# Altium schematic sheet SIM808 dev Board V1.0.2.SchDoc: SIM808 Development Board
size A4; Engineer: Ali Rohanizadeh; DocumentNumber: 1; Revision: 1; SheetNumber: 1; SheetTotal: 1
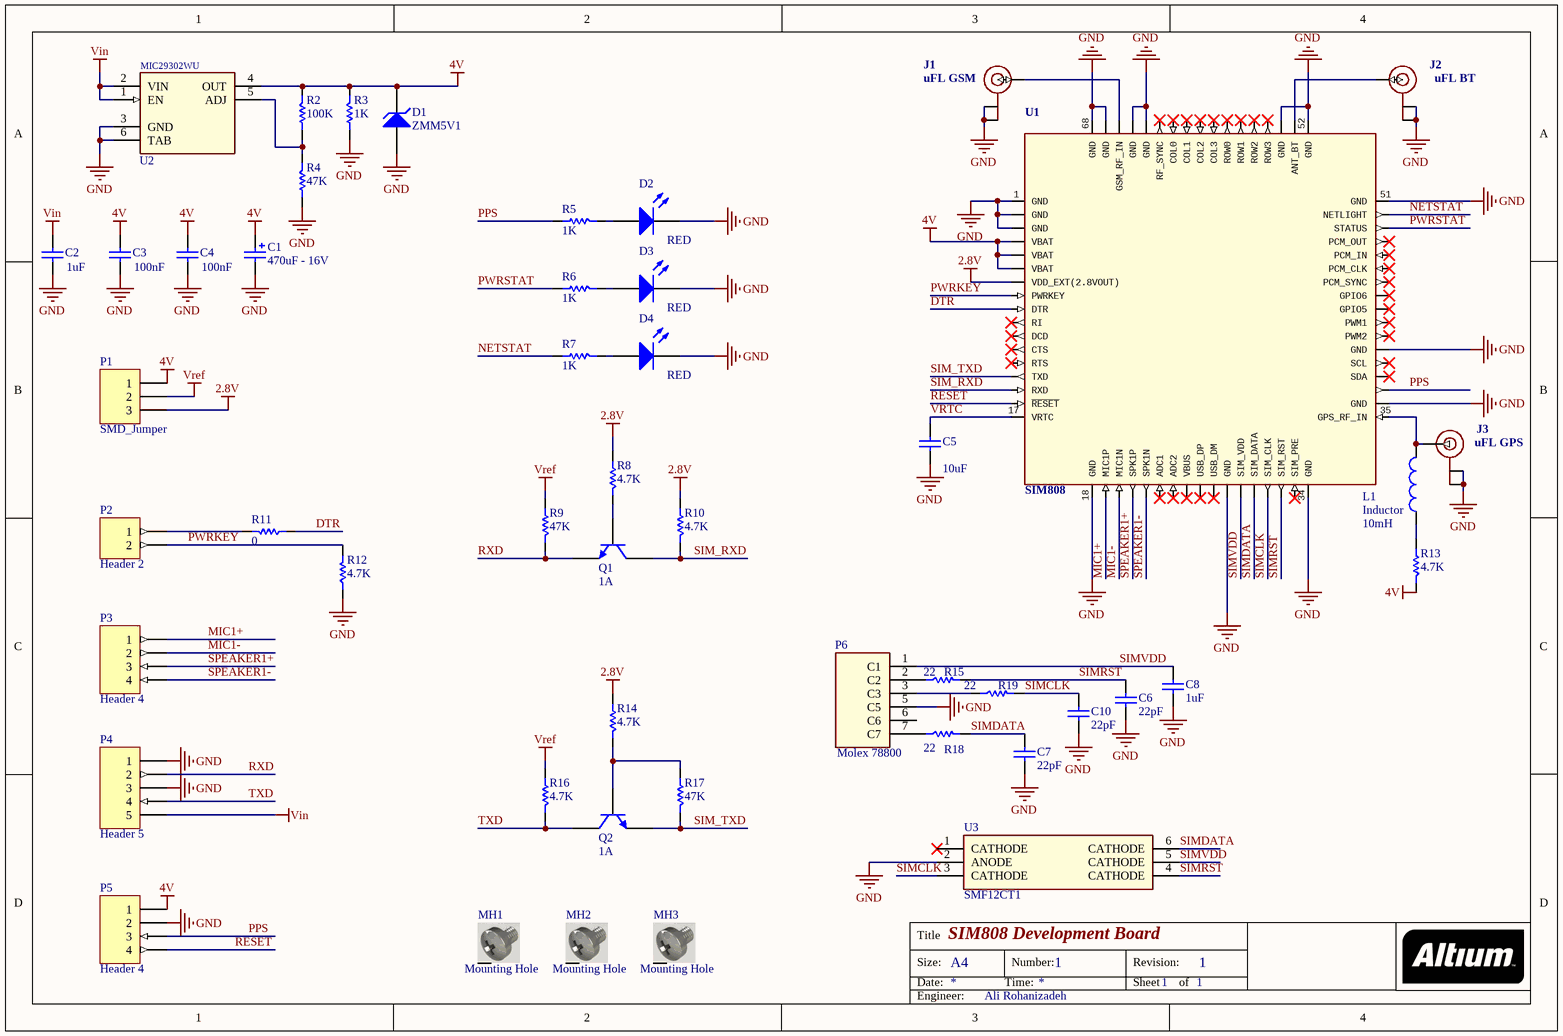
[diagram p0: SIM808 dev Board V1.0.2.SchDoc]

## Parts
C1  value 470uF - 16V  [CAP-D]  (hidden comment: 470uF)
C2  1uF  [CAP0603]
C3  100nF  [CAP0603]
C4  100nF  [CAP0603]
C5  10uF  [CAP1206]
C6  22pF  [CAP0603]
C7  22pF  [CAP0603]
C8  1uF  [CAP0603]
C10  22pF  [CAP0603]
D1  ZMM5V1  [ZMM5V1]
D2  Color: RED  [LED0603R]  (hidden comment: PPS)
D3  Color: RED  [LED0603R]  (hidden comment: STA)
D4  Color: RED  [LED0603R]  (hidden comment: NET)
J1  uFL GSM  [UFL]
J2  uFL BT  [UFL]
J3  uFL GPS  [UFL]
L1  Inductor  value 10mH  [IND0603]
MH1  Mounting Hole  [SCREW-3]  (no BOM)
MH2  Mounting Hole  [SCREW-3]  (no BOM)
MH3  Mounting Hole  [SCREW-3]  (no BOM)
P1  SMD_Jumper  [Jumper Selector SMD]
P2  Header 2  [HDR1X2]
P3  Header 4  [Pin Header 1x4 TH Pitch 2.54mm]
P4  Header 5  [Pin Header 1x5 TH Pitch 2.54mm]
P5  Header 4  [Pin Header 1x4 TH Pitch 2.54mm]
P6  Molex 78800  [MOLEX_78800-0001]
Q1  1A  [SOT-23]
Q2  1A  [SOT-23]
R2  100K  [RES0603]
R3  1K  [RES0603]
R4  47K  [RES0603]
R5  1K  [RES0603]
R6  1K  [RES0603]
R7  1K  [RES0603]
R8  4.7K  [RES0603]
R9  47K  [RES0603]
R10  4.7K  [RES0603]
R11  0  [RES0603]
R12  4.7K  [RES0603]
R13  value 4.7K  [RES0603]  (hidden comment: 22)
R14  4.7K  [RES0603]
R15  22  [RES0603]
R16  4.7K  [RES0603]
R17  47K  [RES0603]
R18  22  [RES0603]
R19  22  [RES0603]
U1  SIM808  [QFN100P2400X2400X260-68N]
U2  MIC29302WU  [TO263-5]  (value not drawn)
U3  SMF12CT1  [INF-PG-SOT-363_M]

## Nets
2.8V: P1.3 R8.2 R10.2 R14.2 U1.7(VDD_EXT(2.8VOUT))
4V: C1.1 C3.1 C4.1 D1.2(K) P1.1 P5.1 R2.1 R3.1 R13.1 U1.4(VBAT) U1.5(VBAT) U1.6(VBAT) U2.4(OUT)
GND: C1.2 C2.2 C3.2 C4.2 C5.2 C6.2 C7.2 C8.2 C10.2 D1.1(A) D2.2(K) D3.2(K) D4.2(K) J1.1(GND) J1.2(GND) J2.1(GND) J2.2(GND) J3.1(GND) J3.2(GND) P4.1 P4.3 P5.2 P6.5(C5) R3.2 R4.2 R12.1 U1.1(GND) U1.2(GND) U1.3(GND) U1.18(GND) U1.28(GND) U1.34(GND) U1.36(GND) U1.40(GND) U1.51(GND) U1.52(GND) U1.54(GND) U1.64(GND) U1.65(GND) U1.67(GND) U1.68(GND) U2.3(GND) U2.6(TAB) U3.2(ANODE)
Vin: C2.1 P4.5 U2.1(EN) U2.2(VIN)
Vref: P1.2 R9.2 R16.2
DTR: R11.1 U1.9(DTR)
MIC1+: P3.1 U1.19(MIC1P)
MIC1-: P3.2 U1.20(MIC1N)
NETSTAT: R7.2 U1.50(NETLIGHT)
PPS: P5.3 R5.2 U1.37(1PPS)
PWRKEY: P2.2 R12.2 U1.8(PWRKEY)
PWRSTAT: R6.2 U1.49(STATUS)
RESET: P5.4 U1.16(~{RESET})
RXD: P4.2 Q1.2(E) R9.1
SIM_RXD: Q1.3(C) R10.1 U1.15(RXD)
SIM_TXD: Q2.2(E) R17.1 U1.14(TXD)
SIMCLK: C10.1 R19.2 U1.31(SIM_CLK) U3.3(CATHODE)
SIMDATA: C7.1 R18.2 U1.30(SIM_DATA) U3.6(CATHODE)
SIMRST: C6.1 R15.2 U1.32(SIM_RST) U3.4(CATHODE)
SIMVDD: C8.1 P6.1(C1) U1.29(SIM_VDD) U3.5(CATHODE)
SPEAKER1+: P3.3 U1.21(SPK1P)
SPEAKER1-: P3.4 U1.22(SPK1N)
TXD: P4.4 Q2.3(C) R16.1
VRTC: C5.1 U1.17(VRTC)
NetD2_1: D2.1(A) R5.1
NetD3_1: D3.1(A) R6.1
NetD4_1: D4.1(A) R7.1
NetJ1_3: J1.3(SIGNAL) U1.66(GSM_RF_IN)
NetJ2_3: J2.3(SIGNAL) U1.53(ANT_BT)
NetJ3_3: J3.3(SIGNAL) L1.2 U1.35(GPS_RF_IN)
NetL1_1: L1.1 R13.2
NetP2_1: P2.1 R11.2
NetP6_2: P6.2(C2) R15.1
NetP6_3: P6.3(C3) R19.1
NetP6_7: P6.7(C7) R18.1
NetQ1_1: Q1.1(B) R8.1
NetQ2_1: Q2.1(B) R14.1 R17.2
NetR2_2: R2.2 R4.1 U2.5(ADJ)

Not connected (* = marked no-connect by the designer): MH1 S; MH2 S; MH3 S; P6 6(C6); U1 10(RI)* 11(DCD)* 12(CTS)* 13(RTS)* 23(ADC1)* 24(ADC2)* 25(VBUS)* 26(USB_DP)* 27(USB_DM)* 33(SIM_PRE)* 38(SDA)* 39(SCL)* 41(PWM2)* 42(PWM1)* 43(GPIO5)* 44(GPIO6)* 45(PCM_SYNC)* 46(PCM_CLK)* 47(PCM_IN)* 48(PCM_OUT)* 55(ROW3)* 56(ROW2)* 57(ROW1)* 58(ROW0)* 59(COL3)* 60(COL2)* 61(COL1)* 62(COL0)* 63(RF_SYNC)*; U3 1(CATHODE)*

## Notes on the sheet
- Title
- Size:
- Date:
- A4
- Time:
- Number:
- Sheet
- Revision:
- of
- Engineer:

## Library data of the parts
C1 = Cap Pol2: SMD Tantalum Capacitor; Published: 8-Jun-2000; LatestRevisionDate: 17-Jul-2002; LatestRevisionNote: Re-released for DXP Platform.; PackageReference: POLAR0.8; Publisher: Altium Limited; PackageDescription: Polarized Capacitor; 2 Leads
C2-C8 C10 = Cap: Capacitor; Published: 8-Jun-2000; LatestRevisionDate: 17-Jul-2002; LatestRevisionNote: Re-released for DXP Platform.; PackageReference: RAD-0.3; Publisher: Altium Limited; PackageDescription: Radial Cap, Thru-Hole; 2 Leads; 0.3 in Pin Spacing
  C2 C8: Value: 1uF
  C3 C4: Value: 100nF
  C5: Value: 10uF
  C6 C7 C10: Value: 22pF
D1 = D Zener: ZENER 5.1V-MINI MELF; Published: 8-Jun-2000; LatestRevisionDate: 17-Jul-2002; LatestRevisionNote: Re-released for DXP Platform.; PackageReference: DIODE-0.7; Publisher: Altium Limited; PackageDescription: Diode, Thru-Hole; 2 Leads; 0.7 in Pin Spacing
D2-D4 = LED0: Typical INFRARED GaAs LED; Published: 8-Jun-2000; LatestRevisionDate: 08-Jul-2005; LatestRevisionNote: Mech Layer 1 removed.; PackageReference: LED-0; Publisher: Altium Limited; PackageDescription: LED; 2 Leads
J1-J3 = ANTENNA_U.FL: U.FL Antenna Connector; GateName_1: G$1; SymbolName_1: U.FL; LibraryName: microbuilder; DeviceSetName: ANTENNA_U.FL
L1 = Inductor: Code_IEC: 1005; Published: 8-Jun-2000; LatestRevisionDate: 29-May-2009; LatestRevisionNote: IPC-7351 Footprint Added.; PackageReference: 0402-A; Publisher: Altium Limited; PackageDescription: Chip Inductor; Code_JEITA: 0402
MH1-MH3 = Board Screw: Board Screw With Spacer
P1 = Header 3: Header, 3-Pin; LatestRevisionDate: 17-Jul-2002; LatestRevisionNote: Re-released for DXP Platform.; Publisher: Altium Limited
P2 = Header 2: Header, 2-Pin; LatestRevisionDate: 17-Jul-2002; LatestRevisionNote: Re-released for DXP Platform.; Publisher: Altium Limited
P3 P5 = Header 4: Header, 4-Pin; LatestRevisionDate: 17-Jul-2002; LatestRevisionNote: Re-released for DXP Platform.; Publisher: Altium Limited
P4 = Header 5: Header, 5-Pin; LatestRevisionDate: 17-Jul-2002; LatestRevisionNote: Re-released for DXP Platform.; Publisher: Altium Limited
P6 = 78800-0001: Molex 78800-0001 1.40mm Height Hinged-style micro-SIM Card Socket without Detect Switch, Surface Mount, 6 Circuits, Halogen-Free, Lead...; MP: 78800-0001; Package: None; Availability: Unavailable; MF: Molex; Price: None; SnapEDA_Link: https://www.snapeda.com/parts/78800-0001/Molex/view-part/?ref=snap; Value: *
Q1 Q2 = 2N3904: Infineon; Published: 8-Jun-2000; LatestRevisionDate: 17-Jan-2003; LatestRevisionNote: PCB Footprint 'BCY-W3/D4.7' replaced; DatasheetDocument: 1997; PackageDocument: Sep-1998; PackageReference: TO-92A; Publisher: Altium Limited; ComponentLink1Description: Manufacturer Link; ComponentLink1URL: http://www.fairchildsemi.com/; ComponentLink2Description: Datasheet; ComponentLink2URL: http://www.fairchildsemi.com/ds/2N%2F2N3904.pdf
R2-R19 = Resistor: Tolerance: 5%; Power: 1/8 W
  R2: Value: 100K
  R3 R5-R7: Value: 1K
  R4 R9 R17: Value: 47K
  R8 R10 R12 R14 R16: Value: 4.7K
  R11: Value: 0
  R15 R18 R19: Value: 22
U1 = SIM808: SIM808 module is a complete Quad-Band GSM/GPRS module which combines GPS technology for satellite navigation.; GateName_1: G$1; SymbolName_1: SIM808_LITERAL; DeviceSetName: GSM_SIM808_LITERAL; LibraryName: microbuilder
U2 = MIC29302WU: MIC29302 Series 16 V 3 A Surface Mount Low Dropout Voltage Regulator - TO-263-5; MP: MIC29302AWU-TR; MF: Microchip; Package: TO-263-5 Microchip; Availability: Unavailable; Price: None; SnapEDA_Link: https://www.snapeda.com/parts/MIC29302AWU-TR/Microchip/view-part/?ref=snap; Value: *
U3 = SMF12CT1: 5-Line Transient Voltage Suppressor Array; MF: ON Semiconductor; Package: SOT-363 ON Semiconductor; SnapEDA_Link: https://www.snapeda.com/parts/SMF12CT1/ON%20Semiconductor/view-part/?ref=snap; MP: SMF12CT1; Availability: Unavailable; Price: None; Value: *